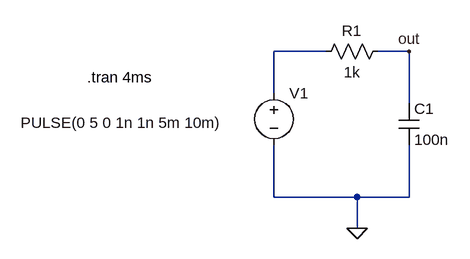
[diagram p0: schematic circuitoRC.asc]
circuitoRC.asc, the LTspice schematic file:
Version 4.1
SHEET 1 880 680
WIRE 16 16 -64 16
WIRE 144 16 96 16
WIRE -64 80 -64 16
WIRE 144 96 144 16
WIRE -64 240 -64 160
WIRE 64 240 -64 240
WIRE 144 240 144 160
WIRE 144 240 64 240
WIRE 64 288 64 240
FLAG 64 288 0
FLAG 144 16 out
SYMBOL cap 128 96 R0
SYMATTR InstName C1
SYMATTR Value 100n
SYMBOL voltage -64 64 R0
WINDOW 3 -390 62 Left 2
WINDOW 123 0 0 Left 0
WINDOW 39 0 0 Left 0
SYMATTR InstName V1
SYMATTR Value PULSE(0 5 0 1n 1n 5m 10m)
SYMBOL res 112 0 R90
WINDOW 0 0 56 VBottom 2
WINDOW 3 32 56 VTop 2
SYMATTR InstName R1
SYMATTR Value 1k
TEXT -352 56 Left 2 !.tran 4ms

The netlist it stands for:
* circuitoRC.asc
C1 out 0 100n
V1 N001 0 PULSE(0 5 0 1n 1n 5m 10m)
R1 out N001 1k
.tran 4ms
.backanno
.end